# Altium schematic sheet MCU.SchDoc
size A4; SheetNumber: 1; SheetTotal: 4
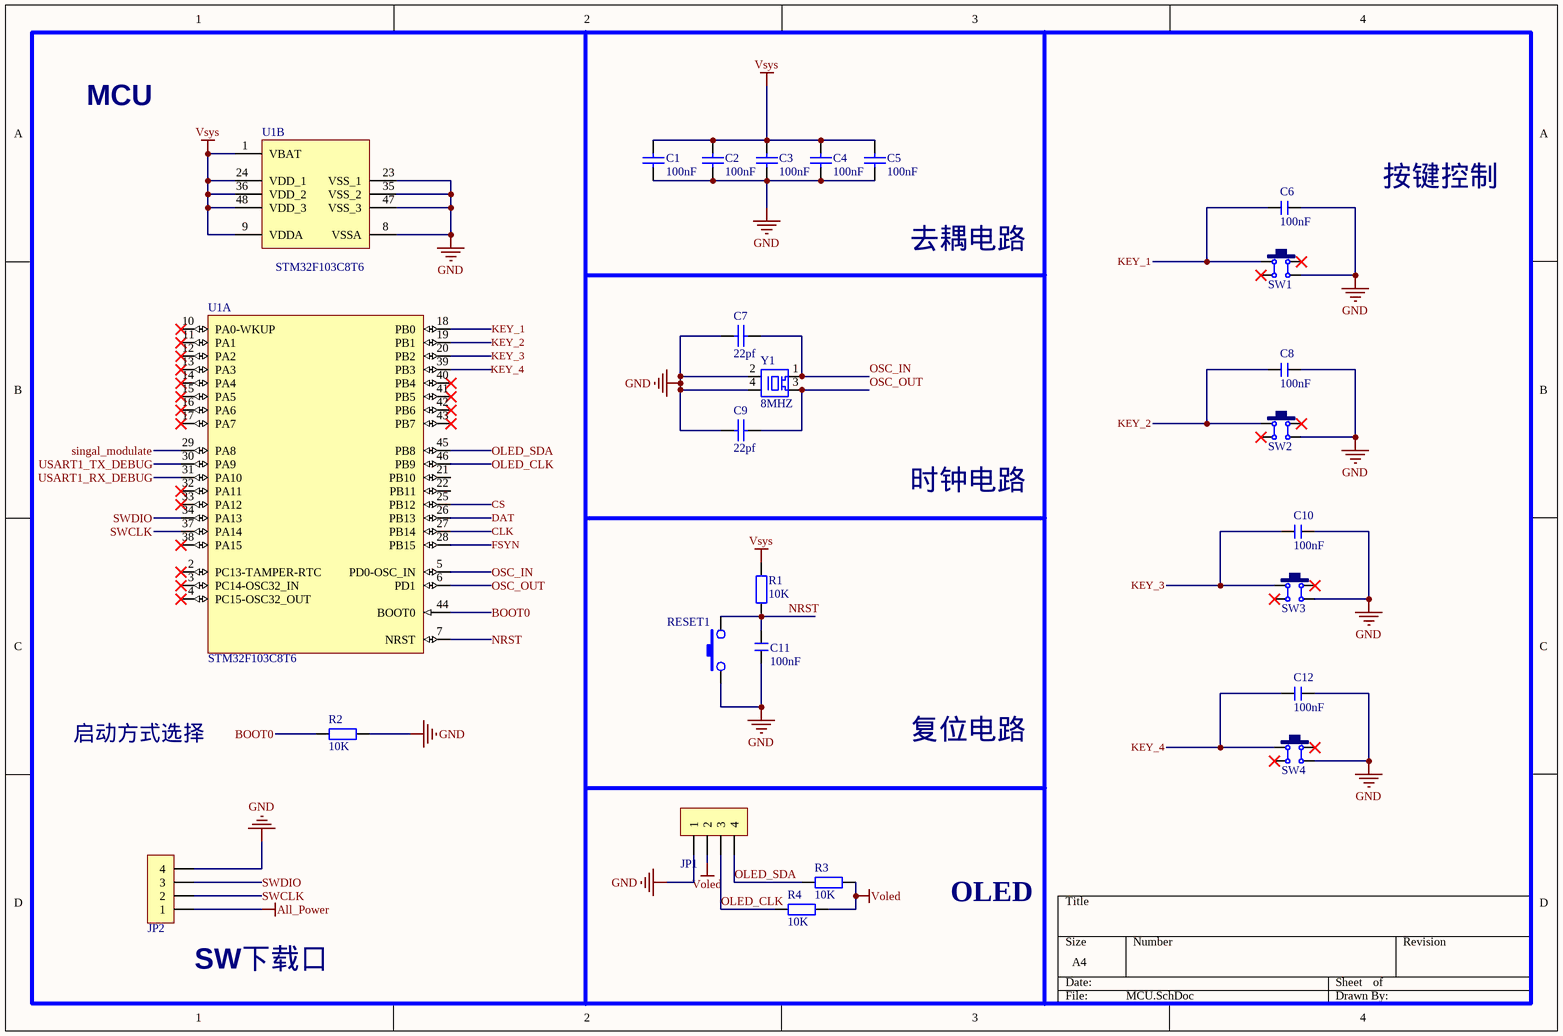
[diagram p0: MCU.SchDoc]

## Parts
C1  100nF  [C0603_M]
C2  100nF  [C0603_M]
C3  100nF  [C0603_M]
C4  100nF  [C0603_M]
C5  100nF  [C0603_M]
C6  100nF  [C0603_M]
C7  22pf  [C0603_M]
C8  100nF  [C0603_M]
C9  22pf  [C0603_M]
C10  100nF  [C0603_M]
C11  100nF  [C0603_M]
C12  100nF  [C0603_M]
JP1  HDR-1X4  [HDR2.54-M-LI-4P]  (value not drawn)
JP2  HDR-1X4  [HDR2.54-WI-4P]  (value not drawn)
R1  10K  [R0603_M]
R2  10K  [R0603_M]
R3  10K  [R0603_M]
R4  10K  [R0603_M]
RESET1  KEY  [SW SMD-3*6*4.3]  (value not drawn)
SW1  12x12x5  [SW SMD-6*6*5]  (value not drawn)
SW2  12x12x5  [SW SMD-6*6*5]  (value not drawn)
SW3  12x12x5  [SW SMD-6*6*5]  (value not drawn)
SW4  12x12x5  [SW SMD-6*6*5]  (value not drawn)
U1  STM32F103C8T6  [LQFP48_N]  (parts A,B of 2)
Y1  8MHZ  [OSC 3225-4P]

## Nets
All_Power: JP2.1
GND: C1.1 C2.1 C3.1 C4.1 C5.1 C6.2 C7.1 C8.2 C9.1 C10.2 C11.2 C12.2 JP1.1 JP2.4 R2.2 RESET1.1 SW1.3 SW2.3 SW3.3 SW4.3 U1.8(VSSA) U1.23(VSS_1) U1.35(VSS_2) U1.47(VSS_3) Y1.2(GND) Y1.4(GND)
Voled: JP1.2 R3.2 R4.2
Vsys: C1.2 C2.2 C3.2 C4.2 C5.2 R1.2 U1.1(VBAT) U1.9(VDDA) U1.24(VDD_1) U1.36(VDD_2) U1.48(VDD_3)
BOOT0: R2.1 U1.44(BOOT0)
CLK: U1.27(PB14)
CS: U1.25(PB12)
DAT: U1.26(PB13)
FSYN: U1.28(PB15)
KEY_1: C6.1 SW1.1 U1.18(PB0)
KEY_2: C8.1 SW2.1 U1.19(PB1)
KEY_3: C10.1 SW3.1 U1.20(PB2)
KEY_4: C12.1 SW4.1 U1.39(PB3)
NRST: C11.1 R1.1 RESET1.2 U1.7(NRST)
OLED_CLK: JP1.3 R4.1 U1.46(PB9)
OLED_SDA: JP1.4 R3.1 U1.45(PB8)
OSC_IN: C7.2 U1.5(PD0-OSC_IN) Y1.1(XTAL1)
OSC_OUT: C9.2 U1.6(PD1) Y1.3(XTAL3)
singal_modulate: U1.29(PA8)
SWCLK: JP2.2 U1.37(PA14)
SWDIO: JP2.3 U1.34(PA13)
USART1_RX_DEBUG: U1.31(PA10)
USART1_TX_DEBUG: U1.30(PA9)

Not connected (* = marked no-connect by the designer): SW1 2* 4*; SW2 2* 4*; SW3 2* 4*; SW4 2* 4*; U1 2(PC13-TAMPER-RTC)* 3(PC14-OSC32_IN)* 4(PC15-OSC32_OUT)* 10(PA0-WKUP)* 11(PA1)* 12(PA2)* 13(PA3)* 14(PA4)* 15(PA5)* 16(PA6)* 17(PA7)* 21(PB10) 22(PB11) 32(PA11)* 33(PA12)* 38(PA15)* 40(PB4)* 41(PB5)* 42(PB6)* 43(PB7)*

## Notes on the sheet
- MCU
- 按键控制
- 去耦电路
- 时钟电路
- 启动方式选择
- 复位电路
- OLED
- (near JP2) SW下载口

## Library data of the parts
C1-C5 = C: 贴片电容/MLCC电容; BOM名称: 无极性贴片电容; 当前库版本V2022.11.14 @淘宝卖家:黄晶宝石: 最新版本发布https://shop463601444.taobao.com
C6 C8 C10 C12 = C: 贴片电容; BOM名称: 无极性贴片电容; 淘宝ID: 封装库来自淘宝 ID：黄晶宝石; 联系售后，技术支持: https://shop463601444.taobao.com; 唯一出售店铺网址: https://shop463601444.taobao.com
C7 C9 = C: 贴片电容; BOM名称: 无极性贴片电容; 联系卖家，免费查找封装: 唯一出售店铺网址https://shop463601444.taobao.com
C11 = C: 无极性贴片电容; 版权归属: 源创客; BOM名称: 无极性贴片电容; 学习资源: www.ooocke.com
JP1 JP2 = Header 4: 4P接插件; 封装库来自淘宝卖家 ID：黄晶宝石: 其他店铺购入均为盗版假冒封装库; 联系卖家，免费查找封装: 唯一出售店铺网址https://shop463601444.taobao.com; BOM名称: 4P接插件
R1 = R: 贴片电阻; 版权归属: 源创客; BOM名称: 贴片电阻; 学习资源: www.ooocke.com
R2 = R: 贴片电阻; 联系卖家，免费查找封装: 唯一出售店铺网址https://shop463601444.taobao.com; BOM名称: 贴片电阻
R3 R4 = R_1: 贴片电阻; 联系卖家，免费查找封装: 唯一出售店铺网址https://shop463601444.taobao.com; BOM名称: 贴片电阻
SW1-SW4 = TSW SMD-12x12: 贴片12x12轻触开关; 版权归属: 封装库来自淘宝 ID：黄晶宝石; BOM名称: 贴片12x12轻触开关; 唯一出售店铺网址: https://shop463601444.taobao.com
U1 = STM32F103C8T6: STM32 ARM-based 32-bit MCU Performance Line with 64 kB Flash, 20 kB Internal RAM, -40 to +85癈 Temperature, 48-Pin LQFP, Tray; DatasheetVersion: rev13.0, Apr-2011; PackageVersion: rev13, Apr-2011; PackageReference: LQFP48; PackageDescription: 48-Pin Low-Profile Quad Flat Pack, 7 x 7 mm Body, 0.5 mm Pitch (LQFP48); ComponentLink1Description: Manufacturer URL; ComponentLink1URL: http://www.st.com/; ComponentLink2Description: STM32F103 Datasheet; ComponentLink2URL: http://www.st.com/internet/com/TECHNICAL_RESOURCES/TECHNICAL_LITERATURE/DATASHEET/CD00161566.pdf; ComponentLink3Description: STM32 Family Web Page; ComponentLink3URL: www.st.com/stm32; 联系售后: https://shop463601444.taobao.com
Y1 = jinzheng